# EAGLE design S3B_SDRAM (EAGLE 5.11)
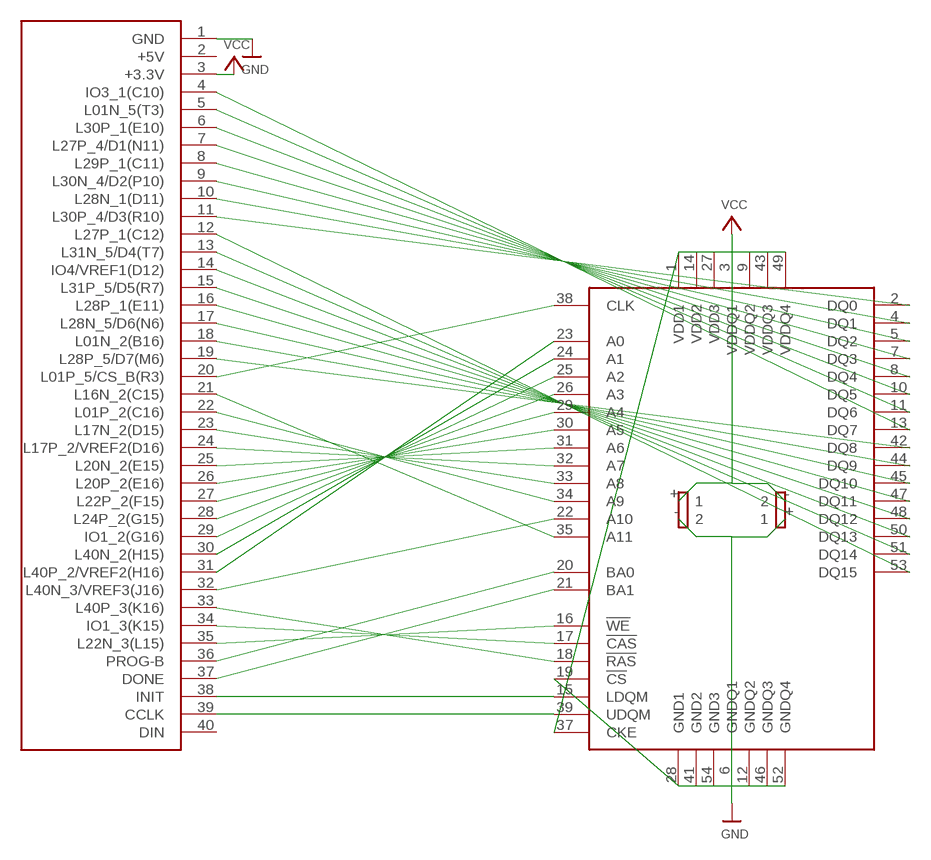
[diagram p0: schematic, sheet 1]

## Parts
U$1  IS42S16400D-TSOP54  [TSOP54]
U$2  DIGILENT_S3_B1  [IDC20X2]
U$5  2P  [2P1S]
U$6  2P  [2P1S]

## Nets
BA0: U$1.20(BA0) U$2.36(PROG-B)
BA1: U$1.21(BA1) U$2.37(DONE)
GND: U$1.6(GNDQ1) U$1.12(GNDQ2) U$1.19(!CS) U$1.28(GND1) U$1.41(GND2) U$1.46(GNDQ3) U$1.52(GNDQ4) U$1.54(GND3) U$2.1(GND) U$5.- U$6.+
LDQM: U$1.15(LDQM) U$2.38(INIT)
N$1: U$1.13(DQ7) U$2.4(IO3_1(C10))
N$2: U$1.11(DQ6) U$2.5(L01N_5(T3))
N$3: U$1.10(DQ5) U$2.6(L30P_1(E10))
N$4: U$1.8(DQ4) U$2.7(L27P_4/D1(N11))
N$5: U$1.7(DQ3) U$2.8(L29P_1(C11))
N$6: U$1.5(DQ2) U$2.9(L30N_4/D2(P10))
N$7: U$1.4(DQ1) U$2.10(L28N_1(D11))
N$8: U$1.2(DQ0) U$2.11(L30P_4/D3(R10))
N$9: U$1.53(DQ15) U$2.12(L27P_1(C12))
N$10: U$1.51(DQ14) U$2.13(L31N_5/D4(T7))
N$11: U$1.50(DQ13) U$2.14(IO4/VREF1(D12))
N$12: U$1.48(DQ12) U$2.15(L31P_5/D5(R7))
N$13: U$1.47(DQ11) U$2.16(L28P_1(E11))
N$14: U$1.45(DQ10) U$2.17(L28N_5/D6(N6))
N$15: U$1.44(DQ9) U$2.18(L01N_2(B16))
N$16: U$1.42(DQ8) U$2.19(L28P_5/D7(M6))
N$17: U$1.38(CLK) U$2.20(L01P_5/CS_B(R3))
N$18: U$1.35(A11) U$2.21(L16N_2(C15))
N$19: U$1.34(A9) U$2.22(L01P_2(C16))
N$20: U$1.33(A8) U$2.23(L17N_2(D15))
N$21: U$1.32(A7) U$2.24(L17P_2/VREF2(D16))
N$22: U$1.31(A6) U$2.25(L20N_2(E15))
N$23: U$1.30(A5) U$2.26(L20P_2(E16))
N$24: U$1.29(A4) U$2.27(L22P_2(F15))
N$25: U$1.26(A3) U$2.28(L24P_2(G15))
N$26: U$1.25(A2) U$2.29(IO1_2(G16))
N$27: U$1.24(A1) U$2.30(L40N_2(H15))
N$28: U$1.23(A0) U$2.31(L40P_2/VREF2(H16))
N$29: U$1.22(A10) U$2.32(L40N_3/VREF3(J16))
N$30: U$1.18(!RAS) U$2.33(L40P_3(K16))
N$31: U$1.17(!CAS) U$2.34(IO1_3(K15))
N$32: U$1.16(!WE) U$2.35(L22N_3(L15))
UDQM: U$1.39(UDQM) U$2.39(CCLK)
VCC: U$1.1(VDD1) U$1.3(VDDQ1) U$1.9(VDDQ2) U$1.14(VDD2) U$1.27(VDD3) U$1.37(CKE) U$1.43(VDDQ3) U$1.49(VDDQ4) U$2.3(+3.3V) U$5.+ U$6.-
Unconnected: U$2.40(DIN)

## Power pins joined to a net without a drawn wire
+5V: U$2.2(+5V)

## Library data of the parts
U$1 = makestuff:IS42S16400D-TSOP54
U$2 = makestuff:DIGILENT_S3_B1
U$5 U$6 = makestuff:2P

## Board
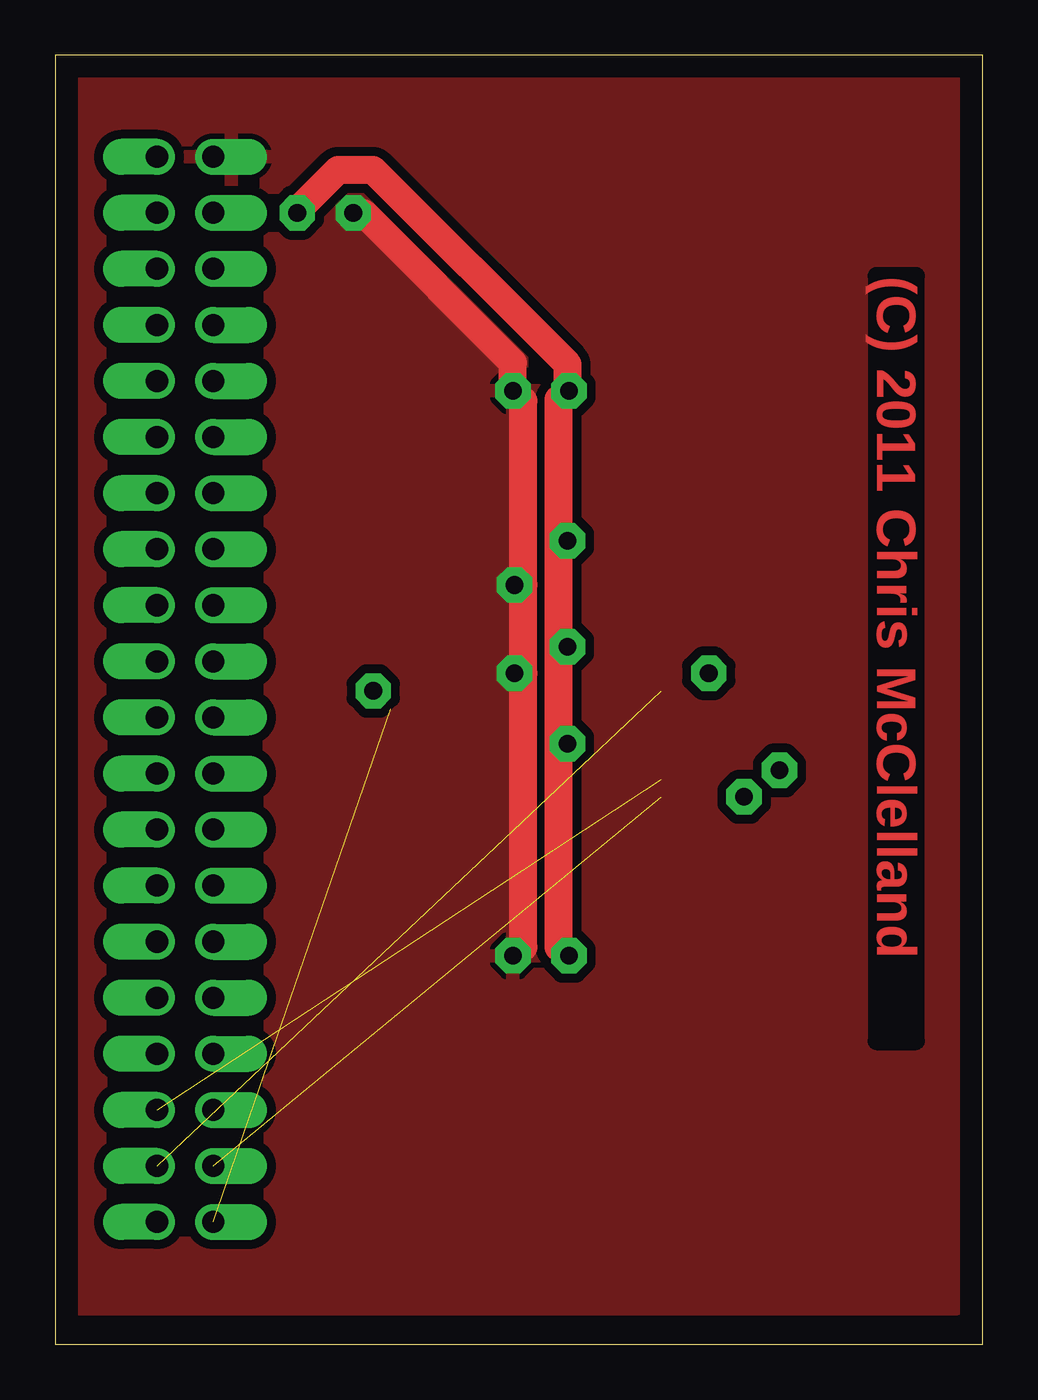
[diagram p1: board, top side]
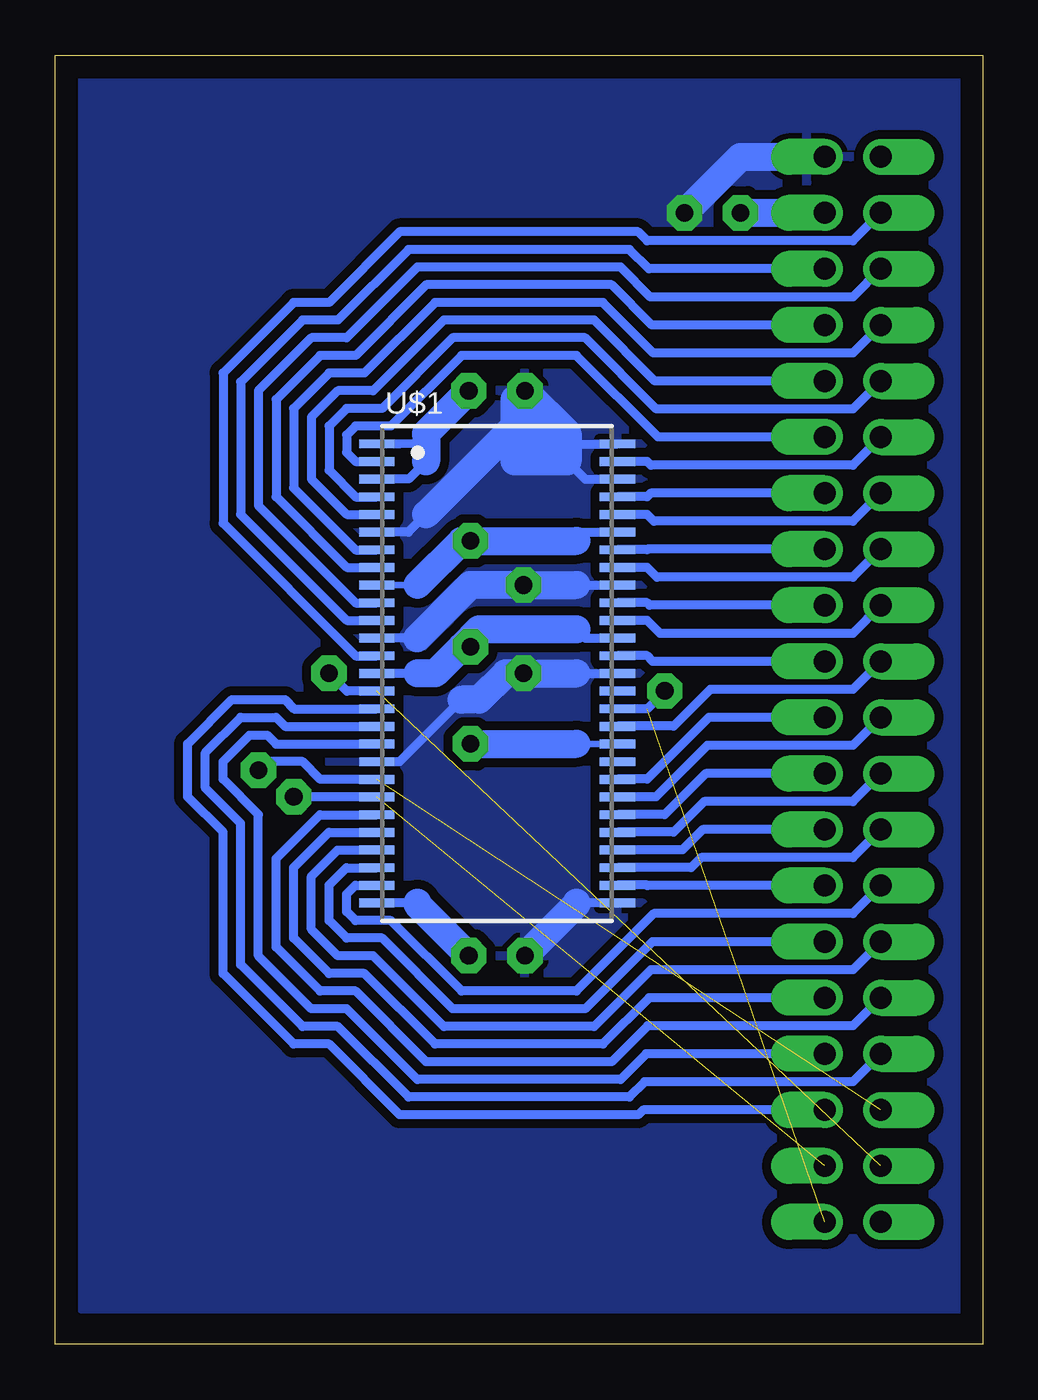
[diagram p2: board, bottom side, seen from below]

Size 42 x 58.4 mm. Coordinates in mm from the lower left corner, seen from the top.
Outline: 0,0 42,0 42,58.4 0,58.4 0,0
Copper layers (1*16): Top 0.035mm / dielectric 1.5mm / Bottom 0.035mm
Design rules "default": minimum track width 10mil, minimum drill 24mil, track to track 8mil, track to pad 8mil, pad to pad 8mil, via to via 8mil, smd to smd 8mil, copper to edge 40mil, drill to drill 8mil, minimum pad ring 10mil, minimum via ring 8mil, stop-mask expansion 4mil, vias tented up to drill 0mil, thermal gap 10mil

### Footprints (pad centres in the part's own frame; a part is rotated, then mirrored left to right if it is on the bottom)
TSOP54 = smd 0.4 x 1.6: 1 -10.39,-5.44; 2 -9.59,-5.44; 3 -8.79,-5.44; 4 -7.99,-5.44; 5 -7.19,-5.44; 6 -6.39,-5.44; 7 -5.59,-5.44; 8 -4.79,-5.44; 9 -3.99,-5.44; 10 -3.19,-5.44; 11 -2.39,-5.44; 12 -1.59,-5.44; 13 -0.79,-5.44; 14 0.01,-5.44; 15 0.81,-5.44; 16 1.61,-5.44; 17 2.41,-5.44; 18 3.21,-5.44; 19 4.01,-5.44; 20 4.81,-5.44; 21 5.61,-5.44; 22 6.41,-5.44; 23 7.21,-5.44; 24 8.01,-5.44; 25 8.81,-5.44; 26 9.61,-5.44; 27 10.41,-5.44; 28 10.41,5.46; 29 9.61,5.46; 30 8.81,5.46; 31 8.01,5.46; 32 7.21,5.46; 33 6.41,5.46; 34 5.61,5.46; 35 4.81,5.46; 36 4.01,5.46; 37 3.21,5.46; 38 2.41,5.46; 39 1.61,5.46; 40 0.81,5.46; 41 0.01,5.46; 42 -0.79,5.46; 43 -1.59,5.46; 44 -2.39,5.46; 45 -3.19,5.46; 46 -3.99,5.46; 47 -4.79,5.46; 48 -5.59,5.46; 49 -6.39,5.46; 50 -7.19,5.46; 51 -7.99,5.46; 52 -8.79,5.46; 53 -9.59,5.46; 54 -10.39,5.46
IDC20X2 = drill 1 pad 1.626 offset: 1 2.54,2.54; 2 0,2.54; 3 2.54,0; 4 0,0; 5 2.54,-2.54; 6 0,-2.54; 7 2.54,-5.08; 8 0,-5.08; 9 2.54,-7.62; 10 0,-7.62; 11 2.54,-10.16; 12 0,-10.16; 13 2.54,-12.7; 14 0,-12.7; 15 2.54,-15.24; 16 0,-15.24; 17 2.54,-17.78; 18 0,-17.78; 19 2.54,-20.32; 20 0,-20.32; 21 2.54,-22.86; 22 0,-22.86; 23 2.54,-25.4; 24 0,-25.4; 25 2.54,-27.94; 26 0,-27.94; 27 2.54,-30.48; 28 0,-30.48; 29 2.54,-33.02; 30 0,-33.02; 31 2.54,-35.56; 32 0,-35.56; 33 2.54,-38.1; 34 0,-38.1; 35 2.54,-40.64; 36 0,-40.64; 37 2.54,-43.18; 38 0,-43.18; 39 2.54,-45.72; 40 0,-45.72
2P1S = drill 0.8 pad 1.6 octagon: + 0,1.27; - 0,-1.27

### Placement (x,y rotation side)
U$1  22,30.4 270 bottom
U$2  4.61,51.26 0 top
U$5  22,43.2 270 top
U$6  22,17.6 90 top

### Tracks (layer width: path | path; a pad name or v marks a point on that pad's centre or on a via)
BA0  (via drill 0.8 pad 1.6)  (1 unrouted)
  Bottom 0.406: U$1.20 29.99,25.59 30.8,26.4 32.4,26.4 v32.8,26
BA1  (via drill 0.8 pad 1.6)  (1 unrouted)
  Bottom 0.406: U$1.21 v31.2,24.79 v31.2,24.8
GND  (via drill 0.8 pad 1.6)
  Top 1.27: 21.2,30.4 21.2,18 20.73,17.53 U$6.+ | 21.2,30.4 21.2,34.4 | 21.2,34.4 v20.8,34.4 | 21.2,30.4 v20.8,30.4 | 21.2,34.4 21.2,42.73 U$5.- 20.73,44.47 13.94,51.26 v13.5,51.26
  Bottom 0.406: 26.79,31.99 U$1.12 25.61,31.99 | 18.39,30.39 U$1.41 | U$1.6 26.01,36.79 25.2,37.6 | U$1.46 18.4,34.39 18.4,34.4 | 23.6,29.2 26.41,26.39 U$1.19 | U$1.28 18.39,19.99 18.4,20 | U$1.54 18.8,40.79 18.8,40.4 | U$1.52 17.99,39.19 18.8,40
  Bottom 1.27: 18.39,30.39 v20.8,30.4 21.6,30.4 22.8,29.2 23.6,29.2 | 25.61,31.99 23.2,34.4 v20.8,34.4 18.4,34.4 | U$2.1 10.96,53.8 v13.5,51.26 | 18.4,20 18.4,19.93 U$6.+ | U$5.- 18.8,41.27 18.8,40.4 18.8,40 20.4,40 | 20.4,40 21.2,40 21.2,41.6 | 21.2,41.6 21.2,42.8 20.8,43.2 20.8,41.6 20,40.8 20,40.4 20.4,40 | 20.4,40 20.4,40.8 21.2,41.6 | 21.2,41.6 25.2,37.6
  pour Top (isolate 0.406): 0.8,57.6 40.8,57.6 40.8,1.6 0.8,1.6
  pour Bottom (isolate 0.406): 0.8,57.6 40.8,57.6 40.8,1.6 0.8,1.6
LDQM  (via drill 0.8 pad 1.6)  (1 unrouted)
  Bottom 0.406: U$1.15 28.79,29.59 v29.6,30.4
N$1
  Bottom 0.406: U$2.4 5.88,49.99 15.19,49.99 15.6,50.4 26.4,50.4 29.6,47.2 31.2,47.2 34.4,44 34.4,37.2 28.39,31.19 U$1.13
N$2
  Bottom 0.406: U$1.11 28.79,32.79 33.6,37.6 33.6,43.6 30.8,46.4 29.2,46.4 26,49.6 16,49.6 15.12,48.72 U$2.5
N$3
  Bottom 0.406: U$2.6 5.88,47.45 15.05,47.45 16.4,48.8 25.6,48.8 28.8,45.6 30.4,45.6 32.8,43.2 32.8,38 28.39,33.59 U$1.10
N$4
  Bottom 0.406: U$1.8 28.79,35.19 32,38.4 32,42.8 30,44.8 28.4,44.8 25.2,48 16.8,48 14.98,46.18 U$2.7
N$5
  Bottom 0.406: U$2.8 5.88,44.91 14.91,44.91 17.2,47.2 24.8,47.2 28,44 29.6,44 31.2,42.4 31.2,38.8 28.39,35.99 U$1.7
N$6
  Bottom 0.406: U$1.5 28.79,37.59 30.4,39.2 30.4,42 29.2,43.2 27.6,43.2 24.4,46.4 17.6,46.4 14.84,43.64 U$2.9
N$7
  Bottom 0.406: U$2.10 5.88,42.37 14.77,42.37 18,45.6 24,45.6 27.2,42.4 28.8,42.4 29.6,41.6 29.6,39.6 28.39,38.39 U$1.4
N$8
  Bottom 0.406: U$1.2 28.39,39.99 28.8,40.4 28.8,41.2 28.4,41.6 26.8,41.6 23.6,44.8 18.4,44.8 14.7,41.1 U$2.11
N$9
  Bottom 0.406: U$2.12 5.88,39.83 15.03,39.83 15.2,40 U$1.53
N$10
  Bottom 0.406: U$2.13 15.04,38.56 15.2,38.4 U$1.51
N$11
  Bottom 0.406: U$2.14 5.88,37.29 14.89,37.29 15.2,37.6 U$1.50
N$12
  Bottom 0.406: U$2.15 15.18,36.02 15.2,36 U$1.48
N$13
  Bottom 0.406: U$2.16 5.88,34.75 14.75,34.75 15.2,35.2 U$1.47
N$14
  Bottom 0.406: U$2.17 15.08,33.48 15.2,33.6 U$1.45
N$15
  Bottom 0.406: U$2.18 5.88,32.21 14.61,32.21 15.2,32.8 U$1.44
N$16
  Bottom 0.406: U$2.19 14.94,30.94 15.2,31.2 U$1.42
N$17
  Bottom 0.406: U$2.20 5.88,29.67 12.33,29.67 14,28 U$1.38
N$18
  Bottom 0.406: U$2.21 12.4,28.4 15.2,25.6 U$1.35
N$19
  Bottom 0.406: U$2.22 5.88,27.13 12.47,27.13 14.8,24.8 U$1.34
N$20
  Bottom 0.406: U$2.23 12.54,25.86 14.4,24 U$1.33
N$21
  Bottom 0.406: U$2.24 5.88,24.59 12.61,24.59 14,23.2 U$1.32
N$22
  Bottom 0.406: U$2.25 12.68,23.32 13.6,22.4 U$1.31
N$23
  Bottom 0.406: U$2.26 5.88,22.05 12.75,22.05 13.2,21.6 U$1.30
N$24
  Bottom 0.406: U$2.27 15.18,20.78 15.2,20.8 U$1.29
N$25
  Bottom 0.406: U$2.28 5.88,19.51 14.89,19.51 18.4,16 23.6,16 26.8,19.2 28.4,19.2 28.8,19.6 28.8,20.4 28.41,20.79 U$1.26
N$26
  Bottom 0.406: U$1.25 28.81,21.59 29.6,20.8 29.6,19.2 28.8,18.4 27.2,18.4 24,15.2 18,15.2 14.96,18.24 U$2.29
N$27
  Bottom 0.406: U$2.30 5.88,16.97 15.03,16.97 17.6,14.4 24.4,14.4 27.6,17.6 29.2,17.6 30.4,18.8 30.4,21.2 29.21,22.39 U$1.24
N$28
  Bottom 0.406: U$1.23 29.61,23.19 31.2,21.6 31.2,18.4 29.6,16.8 28,16.8 24.8,13.6 17.2,13.6 15.1,15.7 U$2.31
N$29
  Bottom 0.406: U$2.32 5.88,14.43 15.17,14.43 16.8,12.8 25.2,12.8 28.4,16 30,16 32,18 32,22 30.01,23.99 U$1.22
N$30
  Bottom 0.406: U$1.18 31.99,27.19 32.4,27.6 33.2,27.6 34.4,26.4 34.4,25.6 32.8,24 32.8,17.6 30.4,15.2 28.8,15.2 25.6,12 16.4,12 15.24,13.16 U$2.33
N$31
  Bottom 0.406: U$2.34 5.88,11.89 15.31,11.89 16,11.2 26,11.2 29.2,14.4 30.8,14.4 33.6,17.2 33.6,23.6 35.2,25.2 35.2,26.8 33.6,28.4 32,28.4 31.59,27.99 U$1.17
N$32
  Bottom 0.406: U$1.16 31.19,28.79 31.6,29.2 34,29.2 36,27.2 36,24.8 34.4,23.2 34.4,16.8 31.2,13.6 29.6,13.6 26.4,10.4 15.6,10.4 15.38,10.62 U$2.35
UDQM  (via drill 0.8 pad 1.6)  (1 unrouted)
  Bottom 0.406: U$1.39 15.2,28.79 v14.4,29.6
VCC  (via drill 0.8 pad 1.6)
  Top 0.406: 22.8,37.2 v23.2,36.4 v23.2,31.6
  Top 1.27: 22.8,27.2 22.8,18 23.27,17.53 U$6.- | 22.8,27.2 22.8,37.2 22.8,42.8 22.87,42.8 U$5.+ 23.2,43.27 23.2,44.4 14.4,53.2 12.8,53.2 10.96,51.36 v10.96,51.26 | 22.8,27.2 v23.2,27.2
  Bottom 0.305: 18.4,36.4 18.39,36.79 | U$1.9 25.61,34.39 25.6,34.4 | 18.4,32.4 17.99,31.99 | U$1.37 18.39,27.19 18.4,27.2
  Bottom 0.406: U$1.9 | U$1.14 25.6,30.4 | U$1.43 17.99,31.99 | U$1.1 26.41,40.79 25.6,40.8 25.2,41.2 | 18.39,36.79 U$1.49 | U$1.3 26,39.2 25.2,40 | U$1.27 25.61,19.99 25.6,20 | v23.2,36.4 25.61,34.39
  Bottom 1.27: 25.2,40 25.2,41.2 25.2,41.27 U$5.+ | 25.6,30.4 24.8,30.4 23.6,31.6 | v23.2,27.2 18.4,27.2 | v10.96,51.26 U$2.3 | 18.4,36.4 v23.2,36.4 23.6,36.4 25.6,34.4 | 18.4,32.4 22.8,32.4 23.6,31.6 | v23.2,31.6 23.6,31.6 | 25.6,20 25.6,19.93 U$6.-

### Text on the board
Top: (C) 2011 Chris McClelland